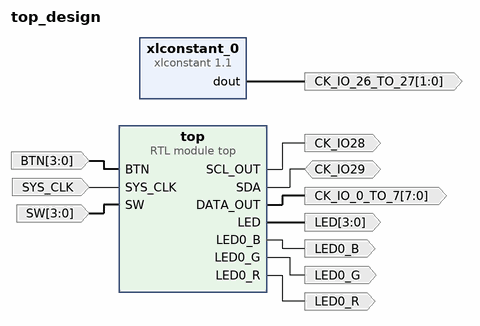
[diagram p0: block diagram of the top level]
# Vivado block design top_design, xc7s50csga324-1, Vivado 2022.2
create_bd_design top_design

create_bd_port -dir I -type clk SYS_CLK
create_bd_port -dir O -from 3 -to 0 LED
create_bd_port -dir O -from 1 -to 0 CK_IO_26_TO_27
create_bd_port -dir O -from 7 -to 0 CK_IO_0_TO_7
create_bd_port -dir O LED0_G
create_bd_port -dir O LED0_B
create_bd_port -dir O LED0_R
create_bd_port -dir I -from 3 -to 0 SW
create_bd_port -dir O CK_IO28
create_bd_port -dir IO CK_IO29
create_bd_port -dir I -from 3 -to 0 BTN

create_bd_cell -type ip -vlnv xilinx.com:ip:xlconstant:1.1 xlconstant_0
set_property -dict {CONFIG.CONST_VAL 2 CONFIG.CONST_WIDTH 2} [get_bd_cells xlconstant_0]
create_bd_cell -type module -reference top top

# ---- connections ----

connect_bd_net -net BTN_0_1 [get_bd_ports BTN] [get_bd_pins top/BTN]
connect_bd_net -net CLK_0_1 [get_bd_ports SYS_CLK] [get_bd_pins top/SYS_CLK]
connect_bd_net [get_bd_ports CK_IO29] [get_bd_pins top/SDA]
connect_bd_net -net SW_0_1 [get_bd_ports SW] [get_bd_pins top/SW]
connect_bd_net -net top_0_LED [get_bd_pins top/LED] [get_bd_ports LED]
connect_bd_net [get_bd_pins top/DATA_OUT] [get_bd_ports CK_IO_0_TO_7]
connect_bd_net [get_bd_pins top/LED0_B] [get_bd_ports LED0_B]
connect_bd_net [get_bd_pins top/LED0_G] [get_bd_ports LED0_G]
connect_bd_net [get_bd_pins top/LED0_R] [get_bd_ports LED0_R]
connect_bd_net -net top_SCL [get_bd_pins top/SCL_OUT] [get_bd_ports CK_IO28]
connect_bd_net [get_bd_pins xlconstant_0/dout] [get_bd_ports CK_IO_26_TO_27]

validate_bd_design
save_bd_design
